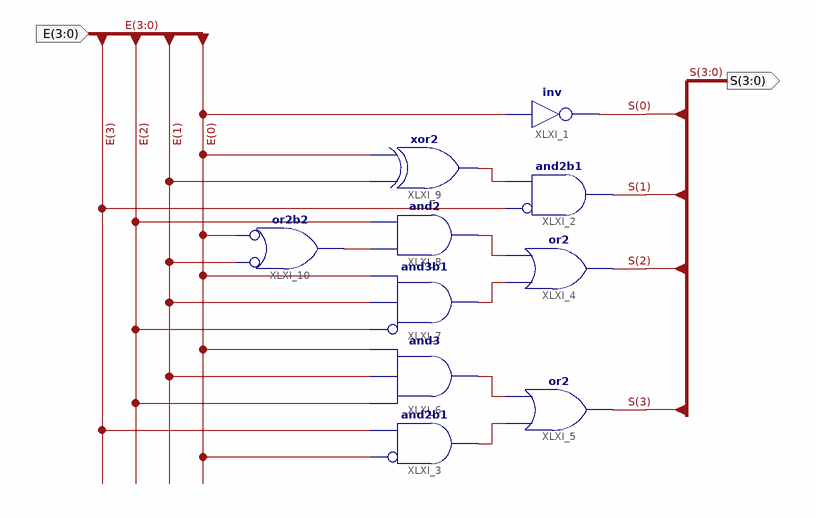
[diagram p0: schematic sheet 1]
// Xilinx ISE schematic bloc_combinatoire.sch (spartan3e) as structural Verilog: 10 symbols, 2 ports
module bloc_combinatoire (
  input  [3:0] E,
  output [3:0] S
);

  wire XLXN_5, XLXN_6, XLXN_7, XLXN_8, XLXN_9, XLXN_10;

  not XLXI_1 (S[0], E[0]);
  and XLXI_2 (S[1], ~E[3], XLXN_9);  // and2b1
  and XLXI_3 (XLXN_5, ~E[0], E[3]);  // and2b1
  or XLXI_4 (S[2], XLXN_7, XLXN_8);
  or XLXI_5 (S[3], XLXN_5, XLXN_6);
  and XLXI_6 (XLXN_6, E[2], E[1], E[0]);
  and XLXI_7 (XLXN_7, ~E[2], E[1], E[0]);  // and3b1
  and XLXI_8 (XLXN_8, XLXN_10, E[2]);
  xor XLXI_9 (XLXN_9, E[1], E[0]);
  or XLXI_10 (XLXN_10, ~E[1], ~E[0]);  // or2b2
endmodule
